# EAGLE design Etch_a_Sketch (EAGLE 9.6.2)
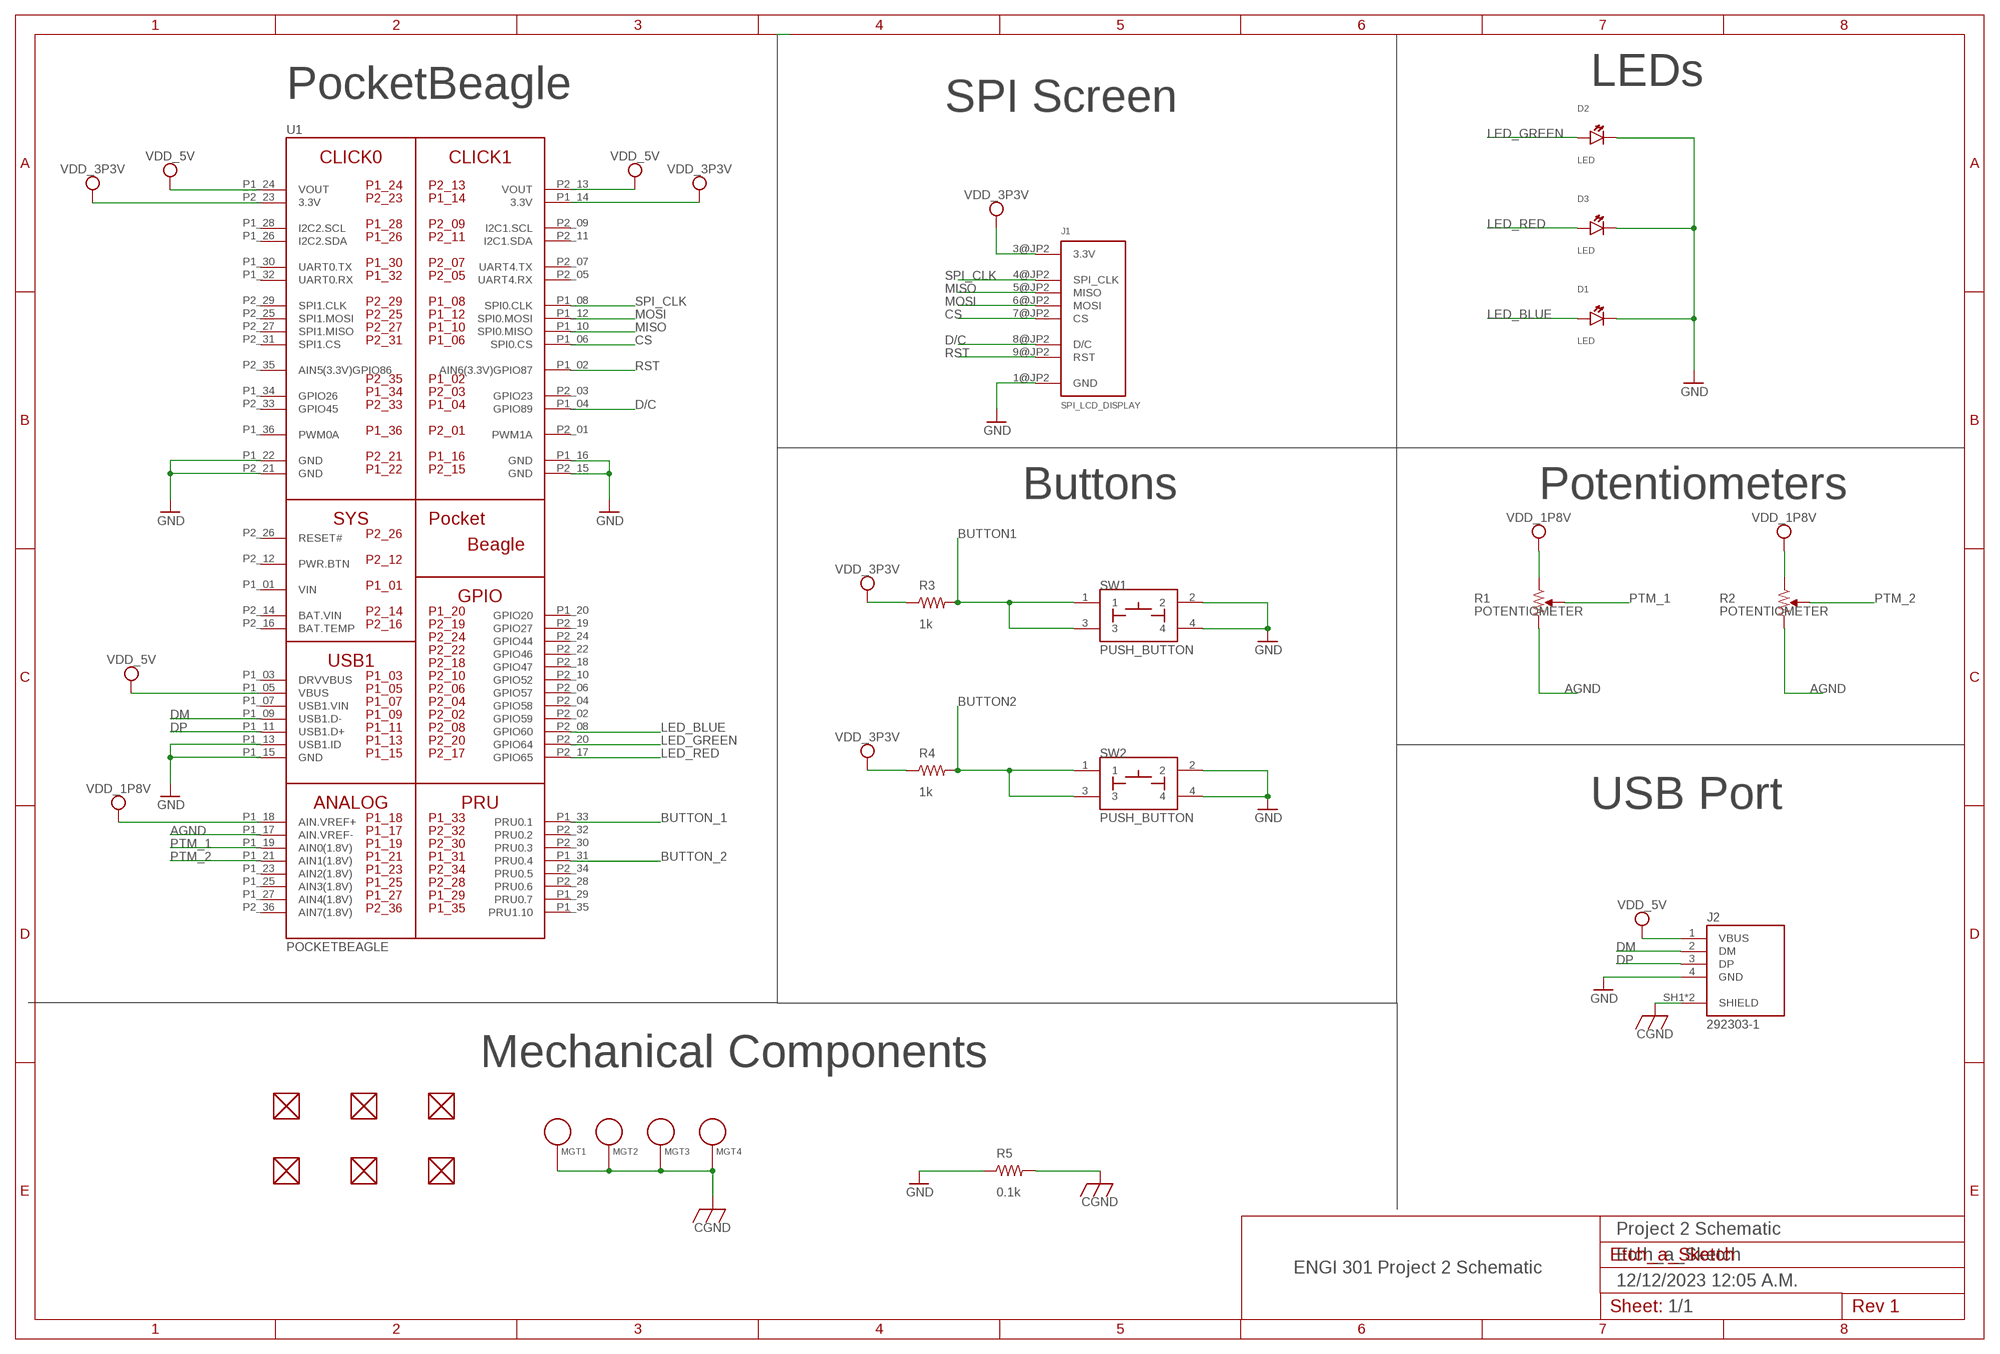
[diagram p0: schematic, sheet 1]

## Parts
D1  LED  [EIA-STD]
D2  LED  [EIA-STD]
D3  LED  [EIA-STD]
FUD1  FIDUCIAL  [FIDUCIAL_40MIL]
FUD2  FIDUCIAL  [FIDUCIAL_40MIL]
FUD3  FIDUCIAL  [FIDUCIAL_40MIL]
FUD4  FIDUCIAL  [FIDUCIAL_40MIL]
FUD5  FIDUCIAL  [FIDUCIAL_40MIL]
FUD6  FIDUCIAL  [FIDUCIAL_40MIL]
J1  SPI_LCD_DISPLAY  [SPI_LCD_DISPLAY]
J2  292303-1  [TE_292303-1]
MGT1  MOUNTING_HOLE  [MOUNTING_HOLE]
MGT2  MOUNTING_HOLE  [MOUNTING_HOLE]
MGT3  MOUNTING_HOLE  [MOUNTING_HOLE]
MGT4  MOUNTING_HOLE  [MOUNTING_HOLE]
R1  POTENTIOMETER  [POT-PO90S]
R2  POTENTIOMETER  [POT-PO90S]
R3  1k  R_R0603  [R0603]
R4  1k  R_R0603  [R0603]
R5  0.1k  R_R0603  [R0603]
SW1  PUSH_BUTTON  [BUTTON_12.5MM]
SW2  PUSH_BUTTON  [BUTTON_12.5MM]
U1  POCKETBEAGLE  [POCKETBEAGLE]

## Nets
AGND: R1.CW R2.CW U1.P1_17(AIN.VREF-)
BUTTON1: R3.2 SW1.1 SW1.3
BUTTON2: R4.2 SW2.1 SW2.3
BUTTON_1: U1.P1_33(PRU0.1)
BUTTON_2: U1.P1_31(PRU0.4)
CGND: J2.SH1(SHIELD) J2.SH2(SHIELD) MGT1.P$1 MGT2.P$1 MGT3.P$1 MGT4.P$1 R5.2
CS: J1.7@JP2(CS) U1.P1_06(SPI0.CS)
D/C: J1.8@JP2(D/C) U1.P1_04(GPIO89)
DM: J2.2(DM) U1.P1_09(USB1.D-)
DP: J2.3(DP) U1.P1_11(USB1.D+)
GND: D1.CATHODE D2.CATHODE D3.CATHODE J1.1@JP2(GND) J2.4(GND) R5.1 SW1.2 SW1.4 SW2.2 SW2.4 U1.P1_13(USB1.ID) U1.P1_15(GND) U1.P1_16(GND) U1.P1_22(GND) U1.P2_15(GND) U1.P2_21(GND)
LED_BLUE: D1.ANODE U1.P2_08(GPIO60)
LED_GREEN: D2.ANODE U1.P2_20(GPIO64)
LED_RED: D3.ANODE U1.P2_17(GPIO65)
MISO: J1.5@JP2(MISO) U1.P1_10(SPI0.MISO)
MOSI: J1.6@JP2(MOSI) U1.P1_12(SPI0.MOSI)
PTM_1: R1.S U1.P1_19(AIN0(1.8V))
PTM_2: R2.S U1.P1_21(AIN1(1.8V))
RST: J1.9@JP2(RST) U1.P1_02(AIN6(3.3V)GPIO87)
SPI_CLK: J1.4@JP2(SPI_CLK) U1.P1_08(SPI0.CLK)
VDD_1P8V: R1.CCW R2.CCW U1.P1_18(AIN.VREF+)
VDD_3P3V: J1.3@JP2(3.3V) R3.1 R4.1 U1.P1_14(3.3V) U1.P2_23(3.3V)
VDD_5V: J2.1(VBUS) U1.P1_05(VBUS) U1.P1_24(VOUT) U1.P2_13(VOUT)
Unconnected: FUD1.P$1 FUD2.P$1 FUD3.P$1 FUD4.P$1 FUD5.P$1 FUD6.P$1 U1.P1_03(DRVVBUS) U1.P1_07(USB1.VIN) U1.P1_20(GPIO20) U1.P1_23(AIN2(1.8V)) U1.P1_25(AIN3(1.8V)) U1.P1_26(I2C2.SDA) U1.P1_27(AIN4(1.8V)) U1.P1_28(I2C2.SCL) U1.P1_29(PRU0.7) U1.P1_30(UART0.TX) U1.P1_32(UART0.RX) U1.P1_34(GPIO26) U1.P1_35(PRU1.10) U1.P1_36(PWM0A) U1.P2_01(PWM1A) U1.P2_02(GPIO59) U1.P2_03(GPIO23) U1.P2_04(GPIO58) U1.P2_05(UART4.RX) U1.P2_06(GPIO57) U1.P2_07(UART4.TX) U1.P2_09(I2C1.SCL) U1.P2_10(GPIO52) U1.P2_11(I2C1.SDA) U1.P2_12(PWR.BTN) U1.P2_16(BAT.TEMP) U1.P2_18(GPIO47) U1.P2_19(GPIO27) U1.P2_22(GPIO46) U1.P2_24(GPIO44) U1.P2_25(SPI1.MOSI) U1.P2_26(RESET#) U1.P2_27(SPI1.MISO) U1.P2_28(PRU0.6) U1.P2_29(SPI1.CLK) U1.P2_30(PRU0.3) U1.P2_31(SPI1.CS) U1.P2_32(PRU0.2) U1.P2_33(GPIO45) U1.P2_34(PRU0.5) U1.P2_35(AIN5(3.3V)GPIO86) U1.P2_36(AIN7(1.8V))

## Notes on the sheet
- PocketBeagle | LEDs
- SPI Screen
- Buttons | Potentiometers
- USB Port
- Mechanical Components
- Project 2 Schematic
- Etch_a_Sketch
- ENGI 301 Project 2 Schematic
- 12/12/2023 12:05 A.M.
- 1/1

## Power pins joined to a net without a drawn wire
BAT.VIN: U1.P2_14(BAT.VIN)
VIN: U1.P1_01(VIN)

## Library data of the parts
D1-D3 = Etch_a_Sketch:LED: EIA-STD LED, LTST-C191TBKT
FUD1-FUD6 = Etch_a_Sketch:FIDUCIAL
J1 = Etch_a_Sketch:SPI_LCD_DISPLAY: 2.8" Adafruit SPI Display
J2 = Etch_a_Sketch:292303-1: CONN USB RECEPT R/A TYPE A 4POS Check availability <https://pricing.snapeda.com/parts/292303-1/TE%20Connectivity/view-part?ref=eda>; AVAILABILITY: In Stock; CENTERLINE_PITCH: 2 mm[.078 in]; COMMENT: 292303-1; DESCRIPTION: Conn; Data; USB; Recept; 2.0; 4 Pos; 1 Port; Rt Angle; A Ser; Tin over Copper; EU_ROHS_COMPLIANCE: Compliant; MF: TE Connectivity; MP: 292303-1; NUMBER_OF_POSITIONS: 4; PACKAGE: None; PRICE: None; PRODUCT_TYPE: Connector; PURCHASE-URL: https://pricing.snapeda.com/search/part/292303-1/?ref=eda
MGT1-MGT4 = Etch_a_Sketch:MOUNTING_HOLE: Chassis Mounting Hole w/GND connection ability
R1 R2 = Etch_a_Sketch:POTENTIOMETER: Potentiometer - Examples: P090S-14T20BR10K (987-1277-ND)
R3-R5 = Etch_a_Sketch:R_: RESISTOR, American symbol
SW1 SW2 = Etch_a_Sketch:PUSH_BUTTON
U1 = Etch_a_Sketch:POCKETBEAGLE

## Board
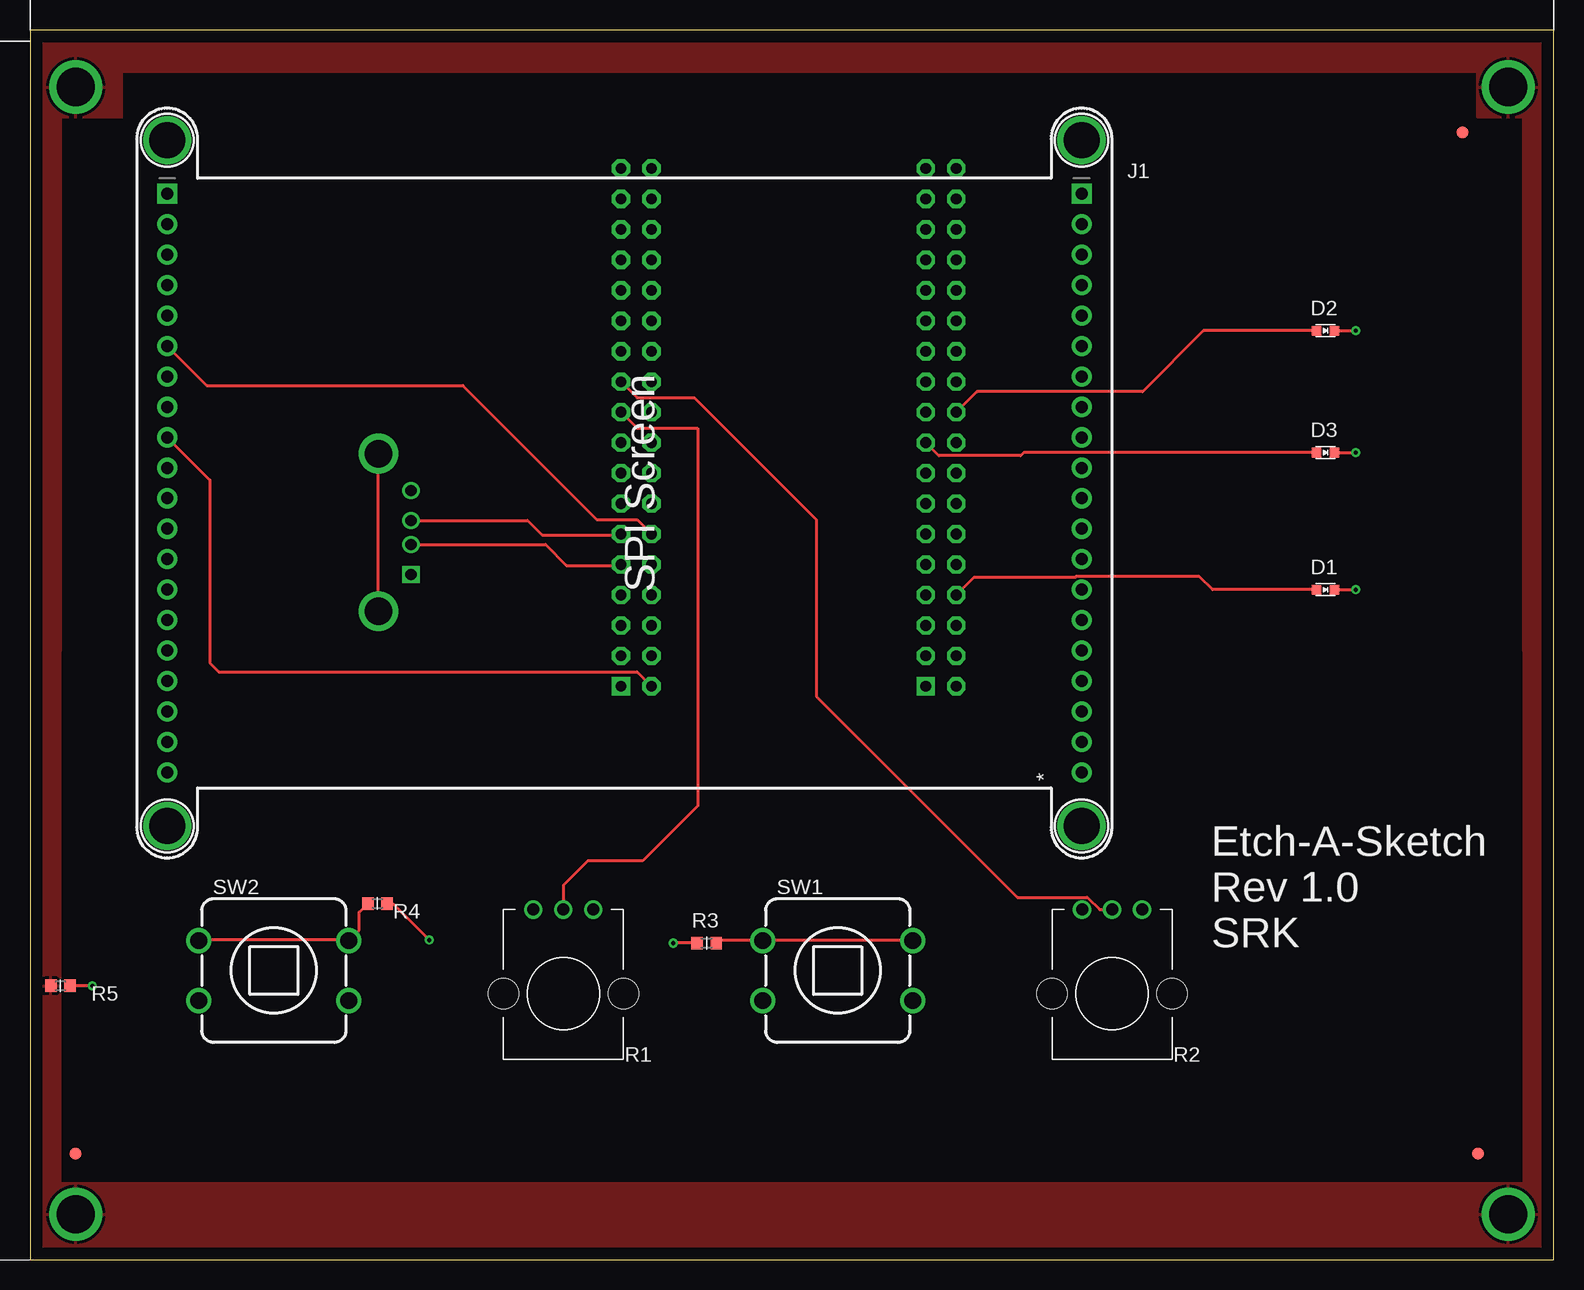
[diagram p1: board, top side]
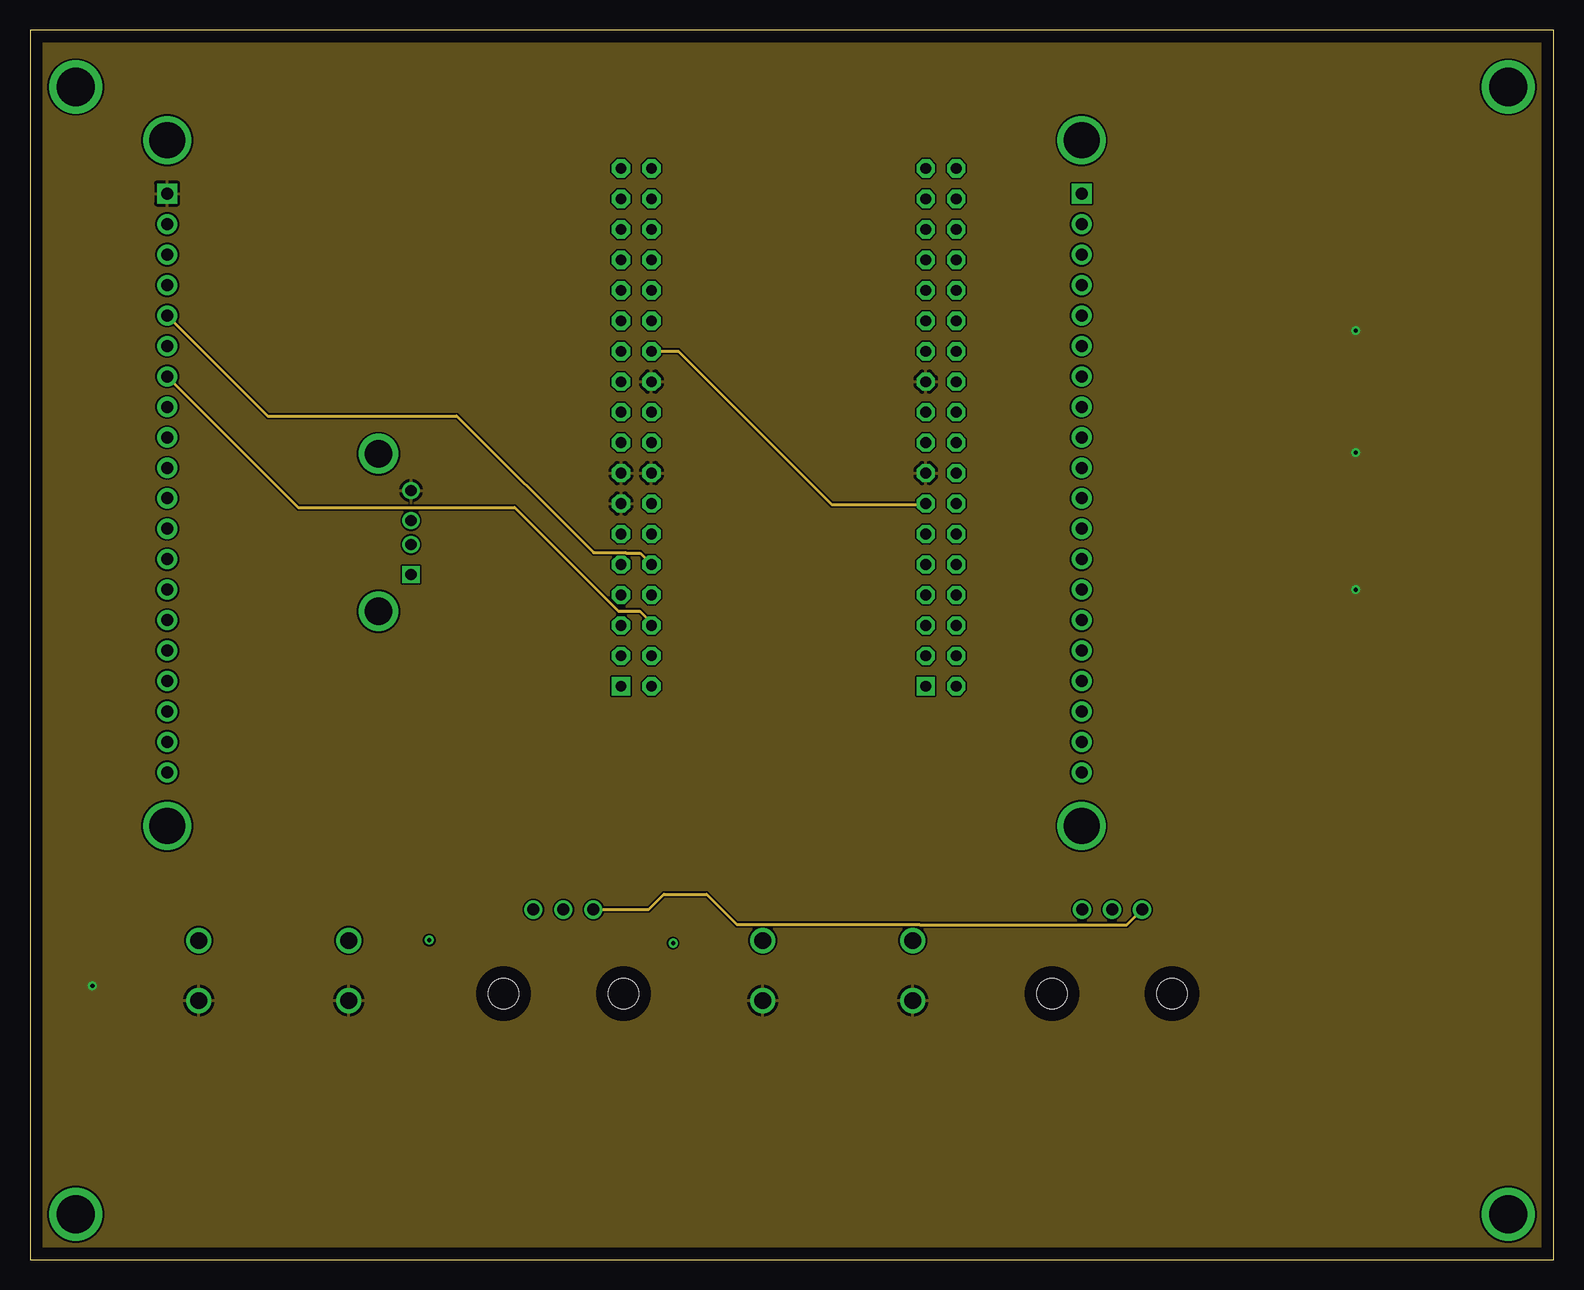
[diagram p2: board, inner layer Route2]
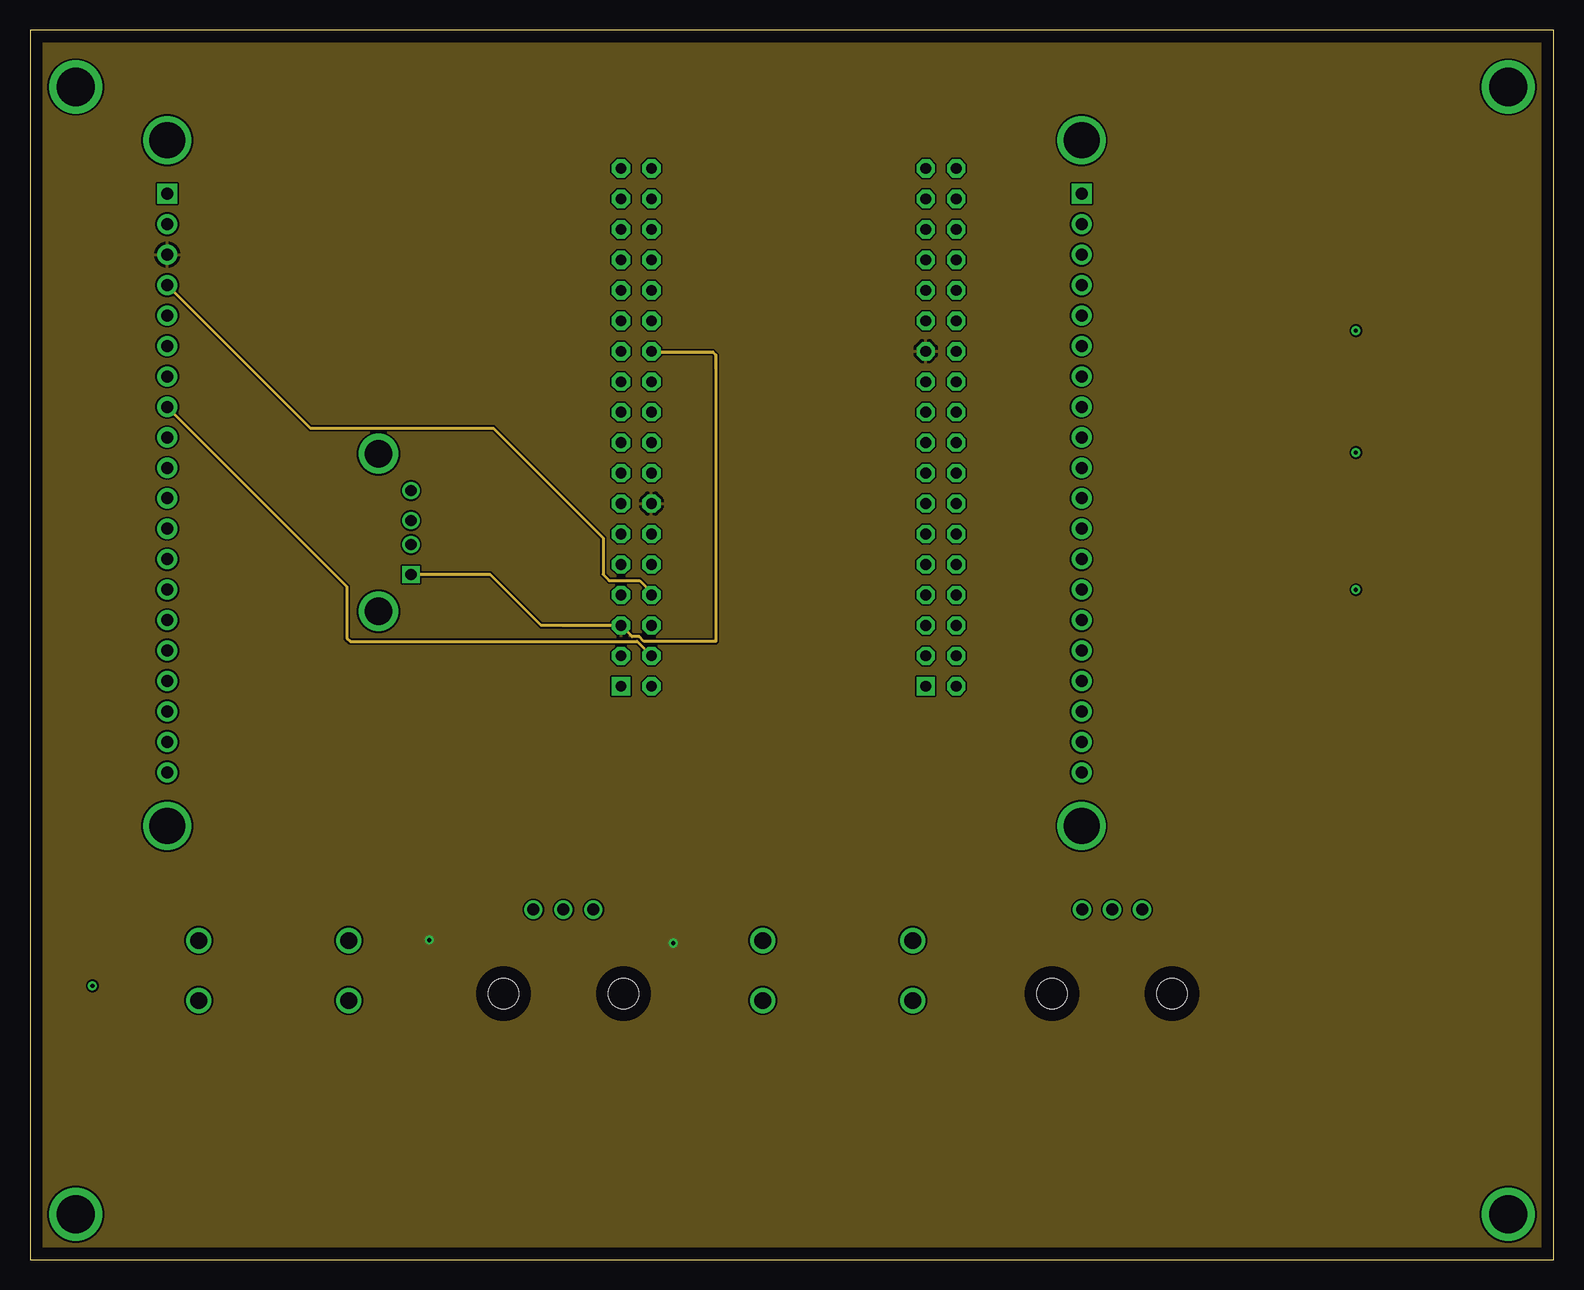
[diagram p3: board, inner layer Route15]
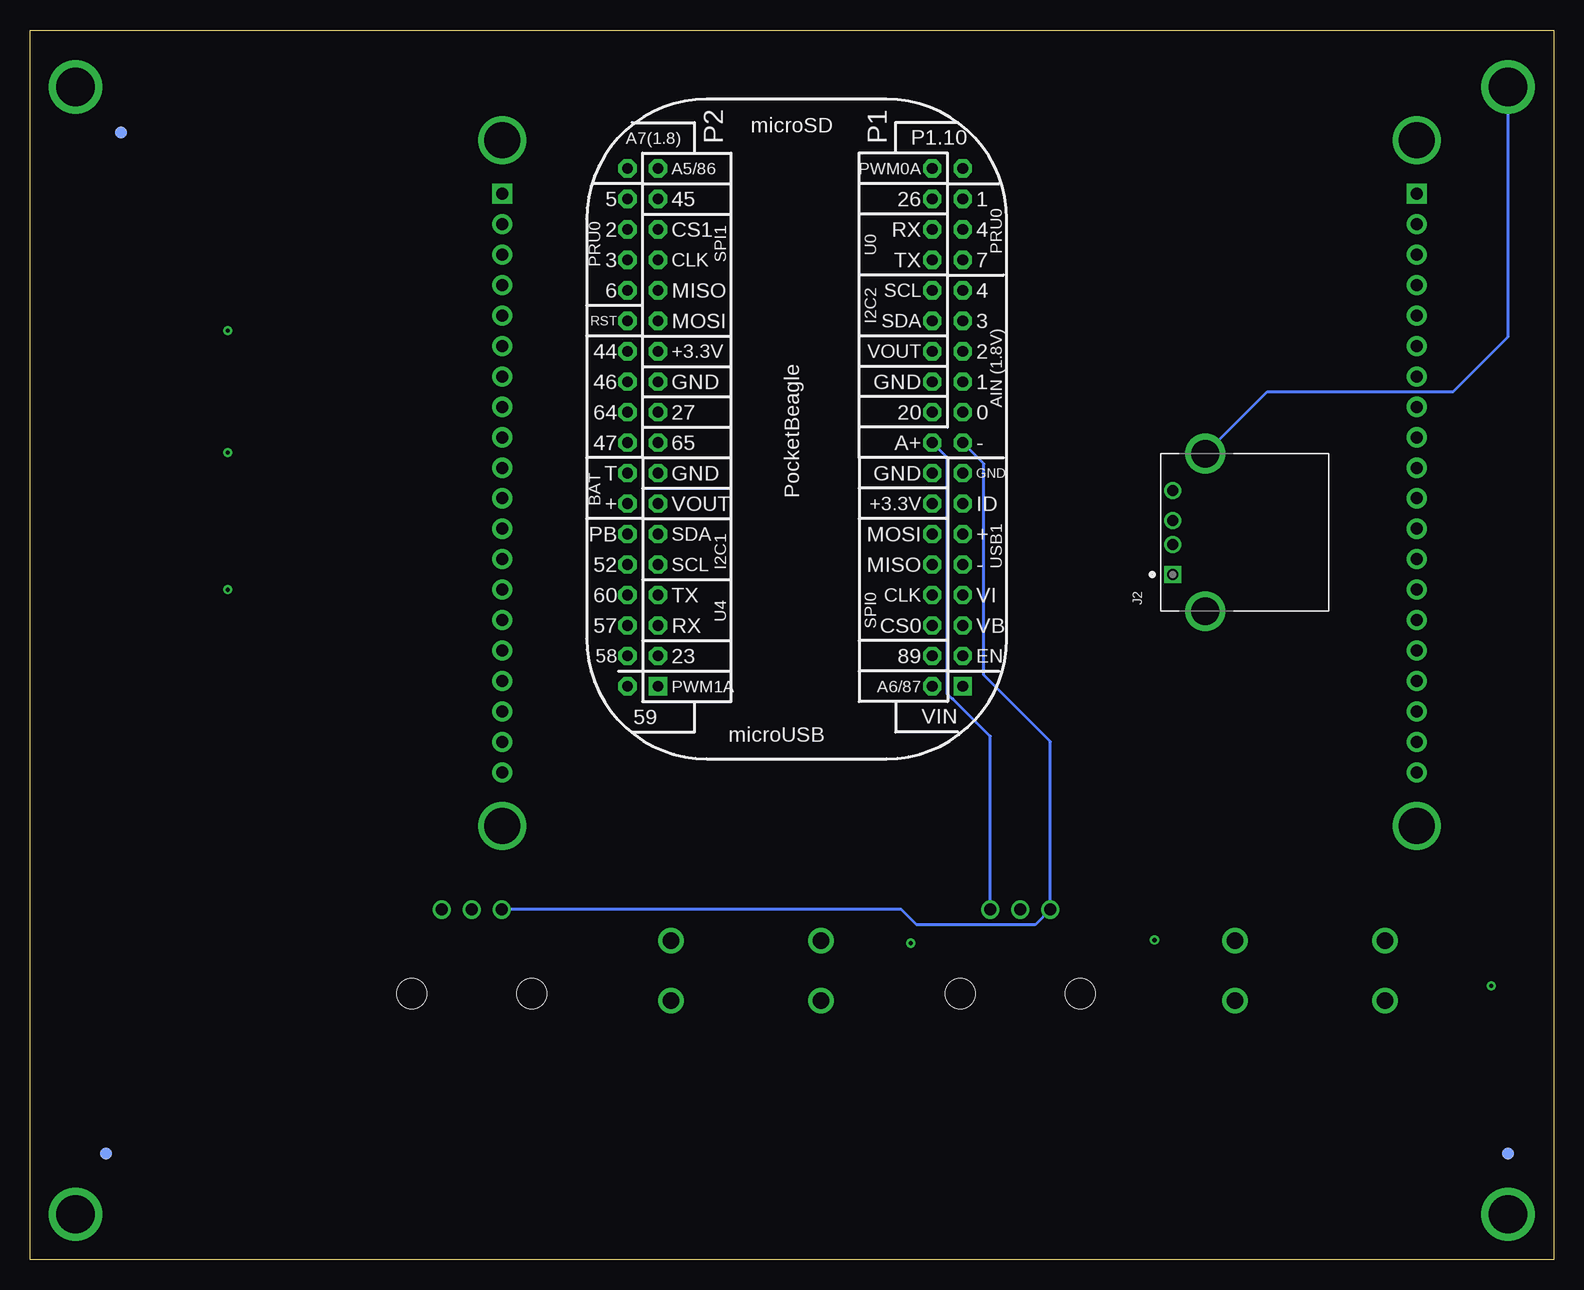
[diagram p4: board, bottom side, seen from below]

Size 126.98 x 102.54 mm. Coordinates in mm from the lower left corner, seen from the top.
Outline: 0,0 126.98,0 126.98,102.54 0,102.54 0,0
Copper layers (1+2*15+16): Top 0.035mm / dielectric 1.5mm / Route2 0.035mm / dielectric 0.15mm / Route15 0.035mm / dielectric 0.2mm / Bottom 0.035mm
Design rules "default *": minimum track width 6mil, minimum drill 0.35mm, track to track 6mil, track to pad 6mil, pad to pad 6mil, via to via 6mil, smd to smd 6mil, copper to edge 40mil, drill to drill 6mil, minimum pad ring 10mil, minimum via ring 8mil, stop-mask expansion 4mil, vias tented up to drill 0mil, thermal gap 10mil

### Footprints (pad centres in the part's own frame; a part is rotated, then mirrored left to right if it is on the bottom)
EIA-STD = smd 0.8 x 0.8: ANODE -0.75,0; CATHODE 0.75,0
FIDUCIAL_40MIL = smd 1.016 x 1.016: P$1 0,0
SPI_LCD_DISPLAY = drill 1 pad 1.676 square: 1@JP1 -24.13,38.1; 1@JP2 -24.13,-38.1 | drill 1 pad 1.676: 2@JP1 -21.59,38.1; 2@JP2 -21.59,-38.1; 3@JP1 -19.05,38.1; 3@JP2 -19.05,-38.1; 4@JP1 -16.51,38.1; 4@JP2 -16.51,-38.1; 5@JP1 -13.97,38.1; 5@JP2 -13.97,-38.1; 6@JP1 -11.43,38.1; 6@JP2 -11.43,-38.1; 7@JP1 -8.89,38.1; 7@JP2 -8.89,-38.1; 8@JP1 -6.35,38.1; 8@JP2 -6.35,-38.1; 9@JP1 -3.81,38.1; 9@JP2 -3.81,-38.1; 10@JP1 -1.27,38.1; 10@JP2 -1.27,-38.1; 11@JP1 1.27,38.1; 11@JP2 1.27,-38.1; 12@JP1 3.81,38.1; 12@JP2 3.81,-38.1; 13@JP1 6.35,38.1; 13@JP2 6.35,-38.1; 14@JP1 8.89,38.1; 14@JP2 8.89,-38.1; 15@JP1 11.43,38.1; 15@JP2 11.43,-38.1; 16@JP1 13.97,38.1; 16@JP2 13.97,-38.1; 17@JP1 16.51,38.1; 17@JP2 16.51,-38.1; 18@JP1 19.05,38.1; 18@JP2 19.05,-38.1; 19@JP1 21.59,38.1; 19@JP2 21.59,-38.1; 20@JP1 24.13,38.1; 20@JP2 24.13,-38.1 | drill 3 pad 3.6: P$1@U$7 -28.575,-38.1; P$1@U$15 28.575,-38.1; P$1@U$16 -28.575,38.1; P$1@U$17 28.575,38.1
TE_292303-1 = drill 0.92 square: 1 0,0 | drill 0.92: 2 2.5,0; 3 4.5,0; 4 7,0 | drill 2.3: SH1 -3.07,-2.71; SH2 10.07,-2.71
MOUNTING_HOLE = drill 3.175 pad 4.445: P$1 0,0
POT-PO90S = drill 1: CCW -2.5,0; CW 2.5,0; S 0,0 | hole 2.5: -5,7; 5,7
R0603 = smd 0.95 x 1.031: 1 -0.8,0; 2 0.8,0
BUTTON_12.5MM = drill 1.4: 1 -6.25,2.5; 2 -6.25,-2.5; 3 6.25,2.5; 4 6.25,-2.5
POCKETBEAGLE = drill 0.889 pad 1.524 square: P1_01 5.91,3.53; P2_01 5.91,28.93 | drill 0.889 pad 1.524 octagon: P1_02 5.91,6.07; P1_03 8.45,3.53; P1_04 8.45,6.07; P1_05 10.99,3.53; P1_06 10.99,6.07; P1_07 13.53,3.53; P1_08 13.53,6.07; P1_09 16.07,3.53; P1_10 16.07,6.07; P1_11 18.61,3.53; P1_12 18.61,6.07; P1_13 21.15,3.53; P1_14 21.15,6.07; P1_15 23.69,3.53; P1_16 23.69,6.07; P1_17 26.23,3.53; P1_18 26.23,6.07; P1_19 28.77,3.53; P1_20 28.77,6.07; P1_21 31.31,3.53; P1_22 31.31,6.07; P1_23 33.85,3.53; P1_24 33.85,6.07; P1_25 36.39,3.53; P1_26 36.39,6.07; P1_27 38.93,3.53; P1_28 38.93,6.07; P1_29 41.47,3.53; P1_30 41.47,6.07; P1_31 44.01,3.53; P1_32 44.01,6.07; P1_33 46.55,3.53; P1_34 46.55,6.07; P1_35 49.09,3.53; P1_36 49.09,6.07; P2_02 5.91,31.47; P2_03 8.45,28.93; P2_04 8.45,31.47; P2_05 10.99,28.93; P2_06 10.99,31.47; P2_07 13.53,28.93; P2_08 13.53,31.47; P2_09 16.07,28.93; P2_10 16.07,31.47; P2_11 18.61,28.93; P2_12 18.61,31.47; P2_13 21.15,28.93; P2_14 21.15,31.47; P2_15 23.69,28.93; P2_16 23.69,31.47; P2_17 26.23,28.93; P2_18 26.23,31.47; P2_19 28.77,28.93; P2_20 28.77,31.47; P2_21 31.31,28.93; P2_22 31.31,31.47; P2_23 33.85,28.93; P2_24 33.85,31.47; P2_25 36.39,28.93; P2_26 36.39,31.47; P2_27 38.93,28.93; P2_28 38.93,31.47; P2_29 41.47,28.93; P2_30 41.47,31.47; P2_31 44.01,28.93; P2_32 44.01,31.47; P2_33 46.55,28.93; P2_34 46.55,31.47; P2_35 49.09,28.93; P2_36 49.09,31.47

### Placement (x,y rotation side)
D1  107.95,55.88 0 top
D2  107.95,77.47 0 top
D3  107.95,67.31 0 top
FUD1  3.81,8.89 0 top
FUD2  119.38,93.98 0 bottom
FUD3  3.81,8.89 0 bottom
FUD4  119.38,93.98 0 top
FUD5  120.65,8.89 0 top
FUD6  120.65,8.89 0 bottom
J1  49.53,64.77 270 top
J2  31.75,57.15 90 bottom
MGT1  3.81,97.79 0 top
MGT2  123.19,97.79 0 top
MGT3  123.19,3.81 0 top
MGT4  3.81,3.81 0 top
R1  44.45,29.21 180 top
R2  90.17,29.21 180 top
R3  56.39,26.42 0 top
R4  28.96,29.72 180 top
R5  2.54,22.86 180 top
SW1  67.31,24.13 0 top
SW2  20.32,24.13 0 top
U1  45.72,41.91 90 bottom

### Tracks (layer width: path | path; a pad name or v marks a point on that pad's centre or on a via)
AGND
  Bottom 0.254: U1.P1_17 47.5,66.39 47.5,48.77 41.95,43.22 R1.CW 43.22,27.94 53.09,27.94 54.36,29.21 R2.CW
BUTTON1
  Top 0.254: SW1.3 SW1.1 57.4,26.63 R3.2
BUTTON2
  Top 0.254: SW2.1 14.11,26.67 26.61,26.67 | 26.61,26.67 27.43,27.49 27.43,28.99 R4.2 | SW2.3 26.61,26.67
CGND
  Top 0.254: J2.SH1 J2.SH2
  Bottom 0.254: J2.SH2 23.87,72.39 8.38,72.39 3.81,76.96 MGT1.P$1
  pour Top: -1.27,50.8 -1.27,-1.27 128.27,-1.27 128.27,50.8 124.46,50.8 124.46,6.35 2.54,6.35 2.54,50.8
  pour Top: -1.27,50.8 -1.27,102.87 128.27,102.87 128.27,50.8 124.46,50.8 124.46,95.25 120.65,95.25 120.65,99.06 7.62,99.06 7.62,95.25 2.54,95.25 2.54,50.8
CS
  Route2 0.254: J1.7@JP2 22.35,62.74 40.39,62.74 49.02,54.1 50.8,54.1 51.79,53.11 U1.P1_06
D/C
  Route15 0.254: J1.8@JP2 26.42,56.13 26.42,51.82 26.67,51.56 50.59,51.56 U1.P1_04
DM
  Top 0.254: J2.2 42.97,59.65 44.7,57.91 49.18,57.91 U1.P1_09
DP
  Top 0.254: J2.3 41.47,61.65 42.67,60.45 49.18,60.45 U1.P1_11
GND  (via drill 0.35 pad 0.61)
  Top 0.254: D3.CATHODE v110.49,67.31 | D2.CATHODE v110.49,77.47 | D1.CATHODE v110.49,55.88 | v5.2,22.86 R5.1
  pour Route2: -2.54,104.14 -2.54,-2.54 129.54,-2.54 129.54,104.14
LED_BLUE
  Top 0.254: D1.ANODE 98.55,55.88 97.43,57 87.17,57 87.06,56.9 78.65,56.9 U1.P2_08
LED_GREEN
  Top 0.254: D2.ANODE 97.79,77.47 92.71,72.39 78.9,72.39 U1.P2_20
LED_RED
  Top 0.254: D3.ANODE 82.8,67.31 82.55,67.06 75.73,67.06 U1.P2_17
MISO
  Route2 0.254: J1.5@JP2 19.81,70.36 35.56,70.36 46.96,58.96 49.66,58.96 49.69,58.93 50.84,58.93 U1.P1_10
MOSI
  Top 0.254: J1.6@JP2 14.73,72.9 36.07,72.9 47.24,61.72 50.59,61.72 U1.P1_12
PTM_1
  Top 0.254: U1.P1_19 50.59,69.34 55.63,69.34 55.63,37.85 51.05,33.27 46.48,33.27 44.45,31.24 R1.S
PTM_2
  Top 0.254: U1.P1_21 50.59,71.88 55.37,71.88 65.53,61.72 65.53,46.99 82.28,30.24 88.1,30.24 89.13,29.21 R2.S
RST
  Top 0.254: J1.9@JP2 14.99,65.02 14.99,49.78 15.75,49.02 50.59,49.02 U1.P1_02
SPI_CLK
  Route15 0.254: J1.4@JP2 23.37,69.34 38.61,69.34 47.75,60.2 47.75,57.15 48.26,56.64 50.8,56.64 51.79,55.65 U1.P1_08
VDD_1P8V
  Route2 0.254: R1.CCW 51.56,29.21 52.83,30.48 56.39,30.48 58.91,27.96 74.11,27.96 74.13,27.94 91.4,27.94 R2.CCW
  Bottom 0.254: R1.CCW 46.95,43.65 50.08,46.78 50.13,46.78 50.55,47.2 50.55,66.9 U1.P1_18
VDD_3P3V  (via drill 0.35 pad 0.61)
  Top 0.254: R4.1 30.23,29.72 v33.27,26.67 | R3.1 55.57,26.44 v53.59,26.42
  pour Route15: -5.08,106.68 -5.08,-5.08 132.08,-5.08 132.08,106.68
VDD_5V
  Route2 0.254: U1.P1_24 54.03,75.76 66.8,62.99 74.58,62.99 U1.P2_13
  Route15 0.254: U1.P1_24 51.86,75.69 56.9,75.69 57.15,75.44 57.15,51.56 51.16,51.56 50.76,51.97 50.18,51.97 U1.P1_05 42.6,52.9 38.35,57.15 J2.1
  pour Route15 (rank 3): 30.48,58.42 30.48,55.88 44.45,55.88 44.45,52.07 50.8,52.07 50.8,54.61 46.99,54.61 46.99,58.42
  pour Route15 (rank 2): 50.55,76.96 50.55,74.42 65.79,74.42 66.04,74.17 66.55,73.66 66.55,61.47 66.8,61.72 75.95,61.72 75.95,64.26 68.83,64.26 68.58,64.52 68.58,77.22 68.33,76.96

### Text on the board
tNames: Etch-A-Sketch | Rev 1.0 | SRK